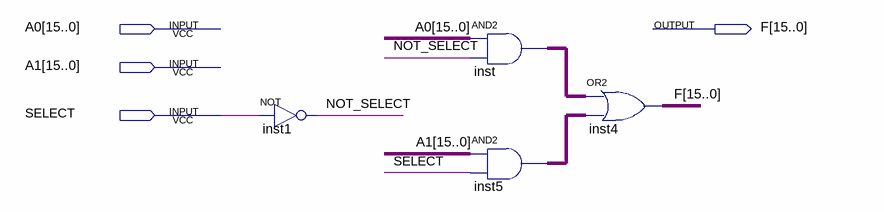
[diagram p0: schematic sheet]
// Quartus schematic MPX2_16.bdf as structural Verilog: 4 symbols, 4 pins
module MPX2_16 (
  input  [15:0] A0,
  input  [15:0] A1,
  input  SELECT,
  output [15:0] F
);

  wire NOT_SELECT;
  wire [15:0] inst5_out, inst_out;

  not inst1 (NOT_SELECT, SELECT);
  assign inst_out = A0 & {16{NOT_SELECT}};  // AND2 inst, 16 bits wide
  assign inst5_out = A1 & {16{SELECT}};  // AND2 inst5, 16 bits wide
  assign F = inst_out | inst5_out;  // OR2 inst4, 16 bits wide
endmodule
